# Altium schematic sheet LM3488_Sheet1.SchDoc
size A4
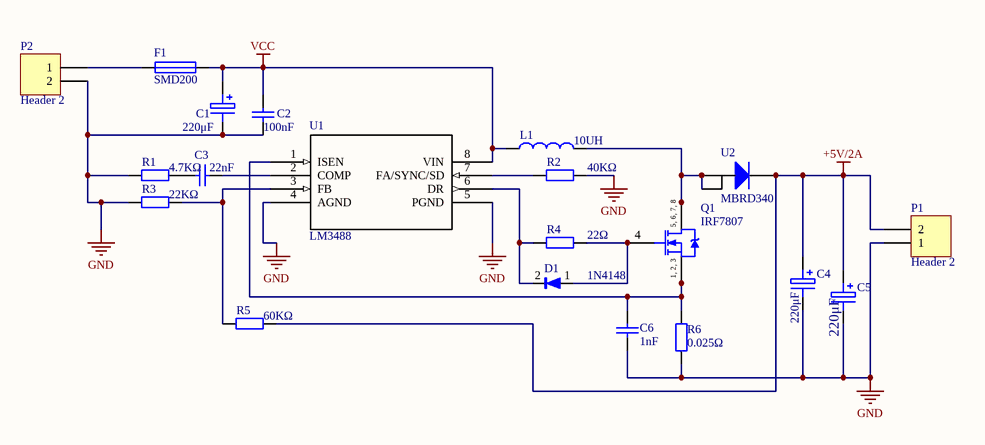
[diagram p0: LM3488_Sheet1.SchDoc]

## Parts
C1  220μF  [RB-220T]
C2  value 100nF  [0805]  (hidden comment: Cap)
C3  value 22nF  [0805]  (hidden comment: Cap)
C4  规格型号: 220μF  [RB-220T]  (hidden comment: 220μF,16V,Ф6.3×7.7mm)
C5  规格型号: 220μF  [RB-220T]  (hidden comment: 220μF,16V,Ф6.3×7.7mm)
C6  value 1nF  [0805]  (hidden comment: Cap)
D1  value 1N4148  [SOD-1005A]  (hidden comment: DIODE1)
F1  SMD200  [1812]
L1  value 10UH  [L-12X12S]  (hidden comment: INDUCTOR1)
P1  Header 2  [8.5端子]
P2  Header 2  [8.5端子]
Q1  IRF7807  [SO-8_N]
R1  4.7KΩ  [0805_R]
R2  40KΩ  [0805_R]
R3  22KΩ  [0805_R]
R4  22Ω  [0805_R]
R5  60KΩ  [0805_R]
R6  0.025Ω  [0805_R]
U1  LM3488  [LM3488]
U2  MBRD340  [TO252]

## Nets
+5V/2A: C4.1 C5.1 P1.2 R5.2 U2.4
GND: C1.2 C2.2 C4.2 C5.2 C6.2 P1.1 P2.2 R1.1 R2.2 R3.1 R6.1 U1.4(AGND) U1.5(PGND)
VCC: C1.1 C2.1 F1.2 L1.1 U1.8(VIN)
NetC3_1: C3.1 U1.2(COMP)
NetC3_2: C3.2 R1.2
NetC6_1: C6.1 Q1.1(S) Q1.2(S) Q1.3(S) R6.2 U1.1(ISEN)
NetD1_1: D1.1 Q1.4(G) R4.2
NetD1_2: D1.2 R4.1 U1.6(DR)
NetF1_1: F1.1 P2.1
NetL1_2: L1.2 Q1.5(D) Q1.6(D) Q1.7(D) Q1.8(D) U2.1 U2.3
NetR2_1: R2.1 U1.7(FA/SYNC/SD)
NetR3_2: R3.2 R5.1 U1.3(FB)

## Notes on the sheet
- (in symbol IRF7807) 5, 6, 7, 8; 1, 2, 3

## Library data of the parts
C1 = CAP ELECTRO1: Electrolytic Capacitor; 物料代码: 1.02.06.0002; 名称: V型铝电解电容; 规格型号: 470μF,16V,Ф6.3×7.7mm; 厂商: 珠海华冠; 贴片和直插: SMT; 现有库存: 4627; Value: 220μF; RoHS: RoHS; ComponentLink1Description: ErpDataInfo; ComponentLink1URL: http://192.168.0.2:8012/ErpExt/ErpData/ListMateriel.aspx?pkey=1.02.06.0002
C2 C3 C6 = Cap: Capacitor; Published: 8-Jun-2000; LatestRevisionDate: 17-Jul-2002; LatestRevisionNote: Re-released for DXP Platform.; PackageReference: RAD-0.3; Publisher: Altium Limited; PackageDescription: Radial Cap, Thru-Hole; 2 Leads; 0.3 in Pin Spacing
C4 C5 = CAP ELECTRO1: Electrolytic Capacitor; 物料代码: 1.02.06.0002; 名称: V型铝电解电容; 厂商: 珠海华冠; 贴片和直插: SMT; 现有库存: 4627; Value: 220μF,16V,Ф6.3×7.7mm; RoHS: RoHS; ComponentLink1Description: ErpDataInfo; ComponentLink1URL: http://192.168.0.2:8012/ErpExt/ErpData/ListMateriel.aspx?pkey=1.02.06.0002
D1 = DIODE1_1: 单向导通二极管; 物料代码: 1.04.07.0002; 名称: 二极管; 规格型号: 1N4148,LL-34,RoHS; 封装: LL-34; 设备封装名称: LL-34_1N4148; 贴片和直插: SMT; RoHS: RoHS; ComponentLink1Description: ErpDataInfo; ComponentLink1URL: http://erp.zlgmcu.com/ErpExt/ErpData/ListMateriel.aspx?pkey=1.04.07.0002
F1 = FUSE1: Fuse; 物料代码: 1.06.03.0003; 名称: 自恢复保险丝; 规格型号: SMD200,1812,RoHS; 设备封装名称: 1812_SMD200; 贴片和直插: SMT; Value: SMD200; 封装: 1812; RoHS: RoHS; ComponentLink1Description: ErpDataInfo; ComponentLink1URL: http://erp.zlgmcu.com/ErpExt/ErpData/ListMateriel.aspx?pkey=1.06.03.0003
L1 = INDUCTOR1: 物料代码: 1.03.01.0049; 名称: 电感; 规格型号: SPRH125-330M; 贴片和直插: SMT; 现有库存: 80; ComponentLink1Description: ErpDataInfo; ComponentLink1URL: http://192.168.0.2:8012/ErpExt/ErpData/ListMateriel.aspx?pkey=1.03.01.0049
P1 P2 = Header 2: Header, 2-Pin; LatestRevisionDate: 17-Jul-2002; LatestRevisionNote: Re-released for DXP Platform.; Publisher: Altium Limited
Q1 = IRF7807: HEXFET Power MOSFET; Published: 17-Sep-2003; LatestRevisionDate: 13-Apr-2006; LatestRevisionNote: IPC-7351 Footprint Added.; DatasheetVersion: 10-Oct-2000; PackageVersion: Feb-2001; PackageReference: SO-8; Publisher: Altium Limited; PackageDescription: 8-Pin Plastic Small Outline Integrated Circuit 1.27 mm Pitch; Code_JEDEC: MS-012-AA; Code_IPC: SOIC127P600-8; ComponentLink1Description: Manufacturer Link; ComponentLink1URL: http://www.irf.com/; ComponentLink2Description: Datasheet; ComponentLink2URL: http://www.irf.com/product-info/datasheets/data/irf7807.pdf
R1-R6 = 0805 1.5KΩ (1501) 1%: 贴片电阻; ComponentLink1Description: 供应商链接; ComponentLink1URL: http://www.szlcsc.com/product/details_4717.html; Package: 0805; Supplier: LC; SuppliersPartNumber: C4310
U2 = MBRD340: 大功率二极管